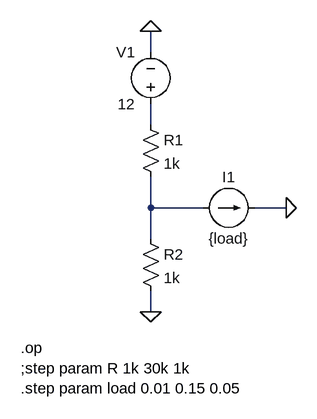
[diagram p0: schematic Dzielnik_current_sweep.asc]
Dzielnik_current_sweep.asc, the LTspice schematic file:
Version 4
SHEET 1 880 680
WIRE 288 0 288 -32
WIRE 288 112 288 80
WIRE 288 240 288 192
WIRE 368 240 288 240
WIRE 496 240 448 240
WIRE 288 288 288 240
WIRE 288 400 288 368
FLAG 496 240 0
FLAG 288 400 0
FLAG 288 -32 0
SYMBOL res 272 96 R0
SYMATTR InstName R1
SYMATTR Value 1k
SYMBOL res 272 272 R0
SYMATTR InstName R2
SYMATTR Value 1k
SYMBOL voltage 288 96 R180
WINDOW 0 24 96 Left 2
WINDOW 3 24 16 Left 2
WINDOW 123 0 0 Left 0
WINDOW 39 0 0 Left 0
SYMATTR InstName V1
SYMATTR Value 12
SYMBOL current 368 240 R270
WINDOW 0 32 40 VTop 2
WINDOW 3 -32 40 VBottom 2
WINDOW 123 0 0 Left 0
WINDOW 39 0 0 Left 0
SYMATTR InstName I1
SYMATTR Value {load}
TEXT 88 456 Left 2 !.op\n;step param R 1k 30k 1k\n.step param load 0.01 0.15 0.05

The netlist it stands for:
* Dzielnik_current_sweep.asc
R1 N001 N002 1k
R2 N002 0 1k
V1 N001 0 12
I1 N002 0 {load}
.op
;step param R 1k 30k 1k
.step param load 0.01 0.15 0.05
.backanno
.end